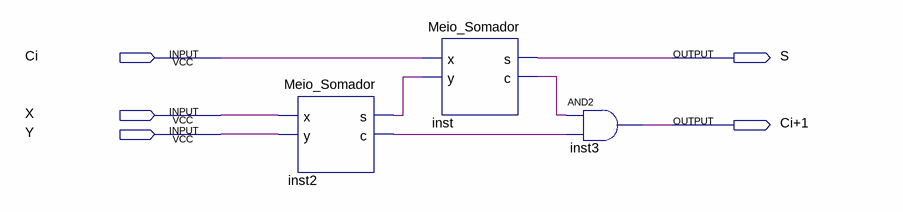
[diagram p0: schematic sheet]
// Quartus schematic Full_Adder.bdf as structural Verilog: 3 symbols, 5 pins
module Full_Adder (
  input  Ci,
  input  X,
  input  Y,
  output S,
  output \Ci+1 
);

  wire inst2_c, inst2_s, inst_c;

  Meio_Somador inst2 (.x(X), .y(Y), .s(inst2_s), .c(inst2_c));
  Meio_Somador inst (.x(Ci), .y(inst2_s), .s(S), .c(inst_c));
  and inst3 (\Ci+1 , inst_c, inst2_c);
endmodule
